# Altium schematic sheet test.SchDoc
size A4; SheetNumber: 1; SheetTotal: 1
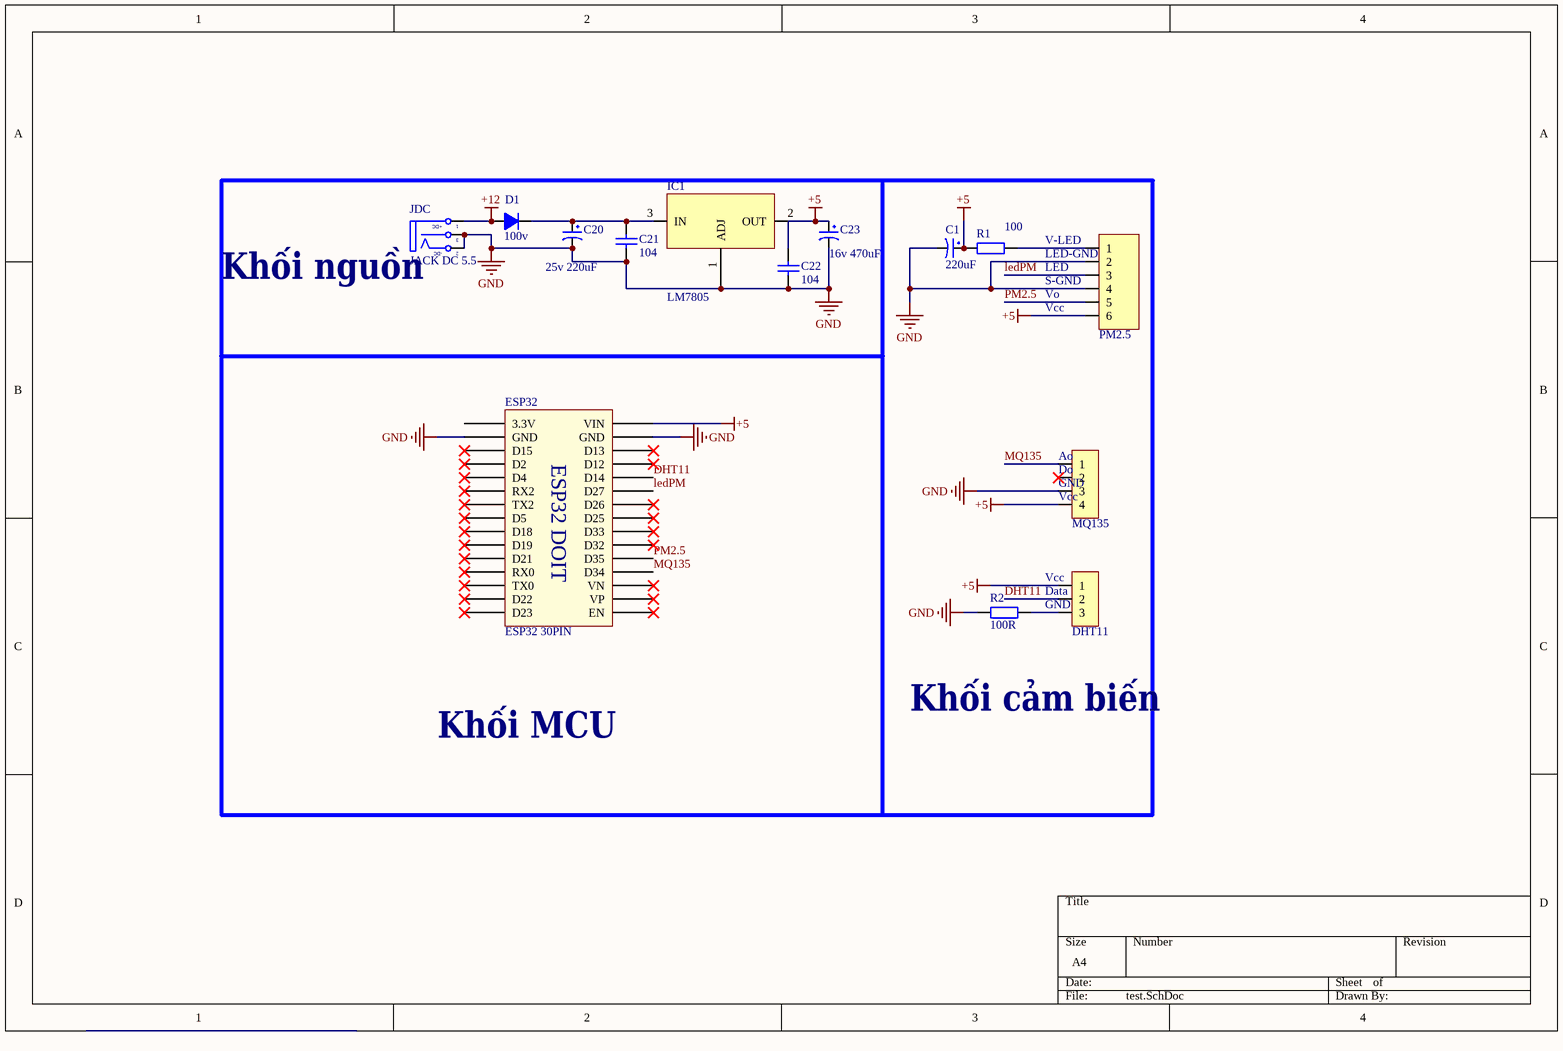
[diagram p0: test.SchDoc]

## Parts
C1  220uF  [Tu hoa 5mm]
C20  25v 220uF  [Tu hoa 8mm]
C21  104  [tu gom]
C22  104  [tu gom]
C23  16v 470uF  [tu hoa 8mm]
D1  100v  [DIODE 1A]
ESP32  ESP32 30PIN  [ESP32 WROOM 32 KIT]
IC1  LM7805  [TO220H1]
JDC  JACK DC 5.5  [JACK DC 5.5]
JP1  PM2.5  [JP 1x6 CT]
JP2  MQ135  [JP 1x4 CT]
JP3  DHT11  [JP 1x3 CT]
R1  100  [tro vach 1/4w]
R2  100R  [tro vach 1/2w]

## Nets
+5: C1.1 C22.2 C23.1 ESP32.15(VIN) IC1.2(OUT) JP1.6 JP2.4 JP3.1 R1.1
+12: D1.1(A) JDC.1(T)
GND: C1.2 C20.2 C21.1 C22.1 C23.2 ESP32.14(GND) ESP32.17(GND) IC1.1(ADJ) JDC.2(TN) JDC.3(S) JP1.2 JP1.4 JP2.3 R2.1
DHT11: ESP32.11(D14) JP3.2
ledPM: ESP32.10(D27) JP1.3
MQ135: ESP32.4(D34) JP2.1
PM2.5: ESP32.5(D35) JP1.5
NetC20_1: C20.1 C21.2 D1.2(K) IC1.3(IN)
NetJP1_1: JP1.1 R1.2
NetJP3_3: JP3.3 R2.2

Not connected (* = marked no-connect by the designer): ESP32 1(EN)* 2(VP)* 3(VN)* 6(D32)* 7(D33)* 8(D25)* 9(D26)* 12(D12)* 13(D13)* 16(3.3V) 18(D15)* 19(D2)* 20(D4)* 21(RX2)* 22(TX2)* 23(D5)* 24(D18)* 25(D19)* 26(D21)* 27(RX0)* 28(TX0)* 29(D22)* 30(D23)*; JP2 2*

## Notes on the sheet
- (near JP1) V-LED
- (near JDC) Khối nguồn
- (near JP1) LED-GND
- LED
- (near JP1) S-GND
- Vo
- (near JP1) Vcc
- (near JP2) Do
- (near JP2) Ao
- (near JP2) GND
- (near JP2) Vcc
- (near JP3) Vcc
- (near JP3) Data
- (near JP3) GND
- Khối cảm biến
- Khối MCU
- (in symbol ESP32 WROOM 32 KIT) ESP32 DOIT
- (in symbol JACK DC 5.5) +DC; -DC

## Library data of the parts
C1 = Tu Hoa 220uF 16V 6x11: Cắm; Don_Vi: Con; So_Chan: 2; Ten_Linh_Kien: Tụ Hóa 220uF 16V 6x11MM; Ma_Hang: MH001348; Chung_Loai: Cắm; Kieu_Chan: *
C20 = Tu Hoa 220uF 25V 8x10: Cắm; Don_Vi: Con; So_Chan: 2; Ten_Linh_Kien: Tụ Hóa 220uF 25V 8x10MM; Ma_Hang: MH006864; Chung_Loai: Cắm; Kieu_Chan: *
C21 C22 = Tu gom 104 50V: Cắm; So_Chan: 2; Ten_Linh_Kien: Tụ gốm 104 100nF 50V; Don_Vi: Con; Ma_Hang: MH004761; Chung_Loai: Cắm; Kieu_Chan: *
C23 = Tu Hoa 470uF 16V 8x11: Cắm; Don_Vi: Con; So_Chan: 2; Ten_Linh_Kien: Tụ Hóa 470uF 16V 8x11MM; Ma_Hang: MH006550; Chung_Loai: Cắm; Kieu_Chan: *
D1 = Diode 1N4007: Cắm; Ten_Linh_Kien: Diode 1N4007 1A (DIP); Don_Vi: Con; Ma_Hang: MH001063; Ghi Chu: *; Kieu_Chan: *; Chung_Loai: Cắm
ESP32 = ESP32 WROOM 32 KIT
IC1 = LM317 TO220: Cắm; Ten_Linh_Kien: LM317T TO220 REG LDO ADJ 1.5A; Ma_Hang: MH003115; Don_Vi: Con; Kieu_Chan: *; Ghi_Chu: *; Chung_Loai: Cắm
JDC = JACK DC 5.5: Value: Jac DC
JP1 = JP 1x6 2.54 Cai Thang: Cắm; Ten_Linh_Kien: Jump Đơn Cái 2.54MM 1x20P Thẳng; Don_Vi: Con; Ma_Hang: MH004006; Ghi_Chu: *; Kieu_Chan: *; Chung_Loai: Cắm
JP2 = JP 1x4 2.54 Cai Thang: Cắm; Ten_Linh_Kien: Jump Đơn Cái 2.54MM 1x20P Thẳng; Don_Vi: Con; Ma_Hang: MH004006; Ghi_Chu: *; Kieu_Chan: *; Chung_Loai: Cắm
JP3 = JP 1x3 2.54 Cai Thang: Cắm; Ten_Linh_Kien: Jump Đơn Cái 2.54MM 1x20P Thẳng; Don_Vi: Con; Ma_Hang: MH004006; Ghi_Chu: *; Kieu_Chan: *; Chung_Loai: Cắm
R1 = Tro Vach 1/4W 5% 68k: Cắm; Don_Vi: Con; So_Chan: 2; Ten_Linh_Kien: Trở Vạch 1/4w 5% 68k; Ma_Hang: MH007332; Kieu_Chan: *; Chung_Loai: Cắm
R2 = Tro Vach 1/2W 5% 100R: Cắm; So_Chan: 2; Ten_Linh_Kien: Trở 5% 1/2w 100R; Ma_Hang: MH007106; Don_Vi: Con; Chung_Loai: Cắm; Kieu_Chan: *